# EasyEDA Pro project GD32E230CBT6_V1.0.0_2023-02-26.eprj

# Schematic GD32E230CBT6
Create Date: 2023-02-26; Page Name: GD32E230CBT6; Project Name: GD32E230CBT6_V1.0.0_2023-02-26; Schematic Name: GD32E230CBT6; Update Date: 2023-02-26; Company: 浙江工商大学; Drawed: 卷心菜; Page Size: A4; Part Number: JLCPCB-002; Reviewed: 卷心菜; Version: V1.0.0
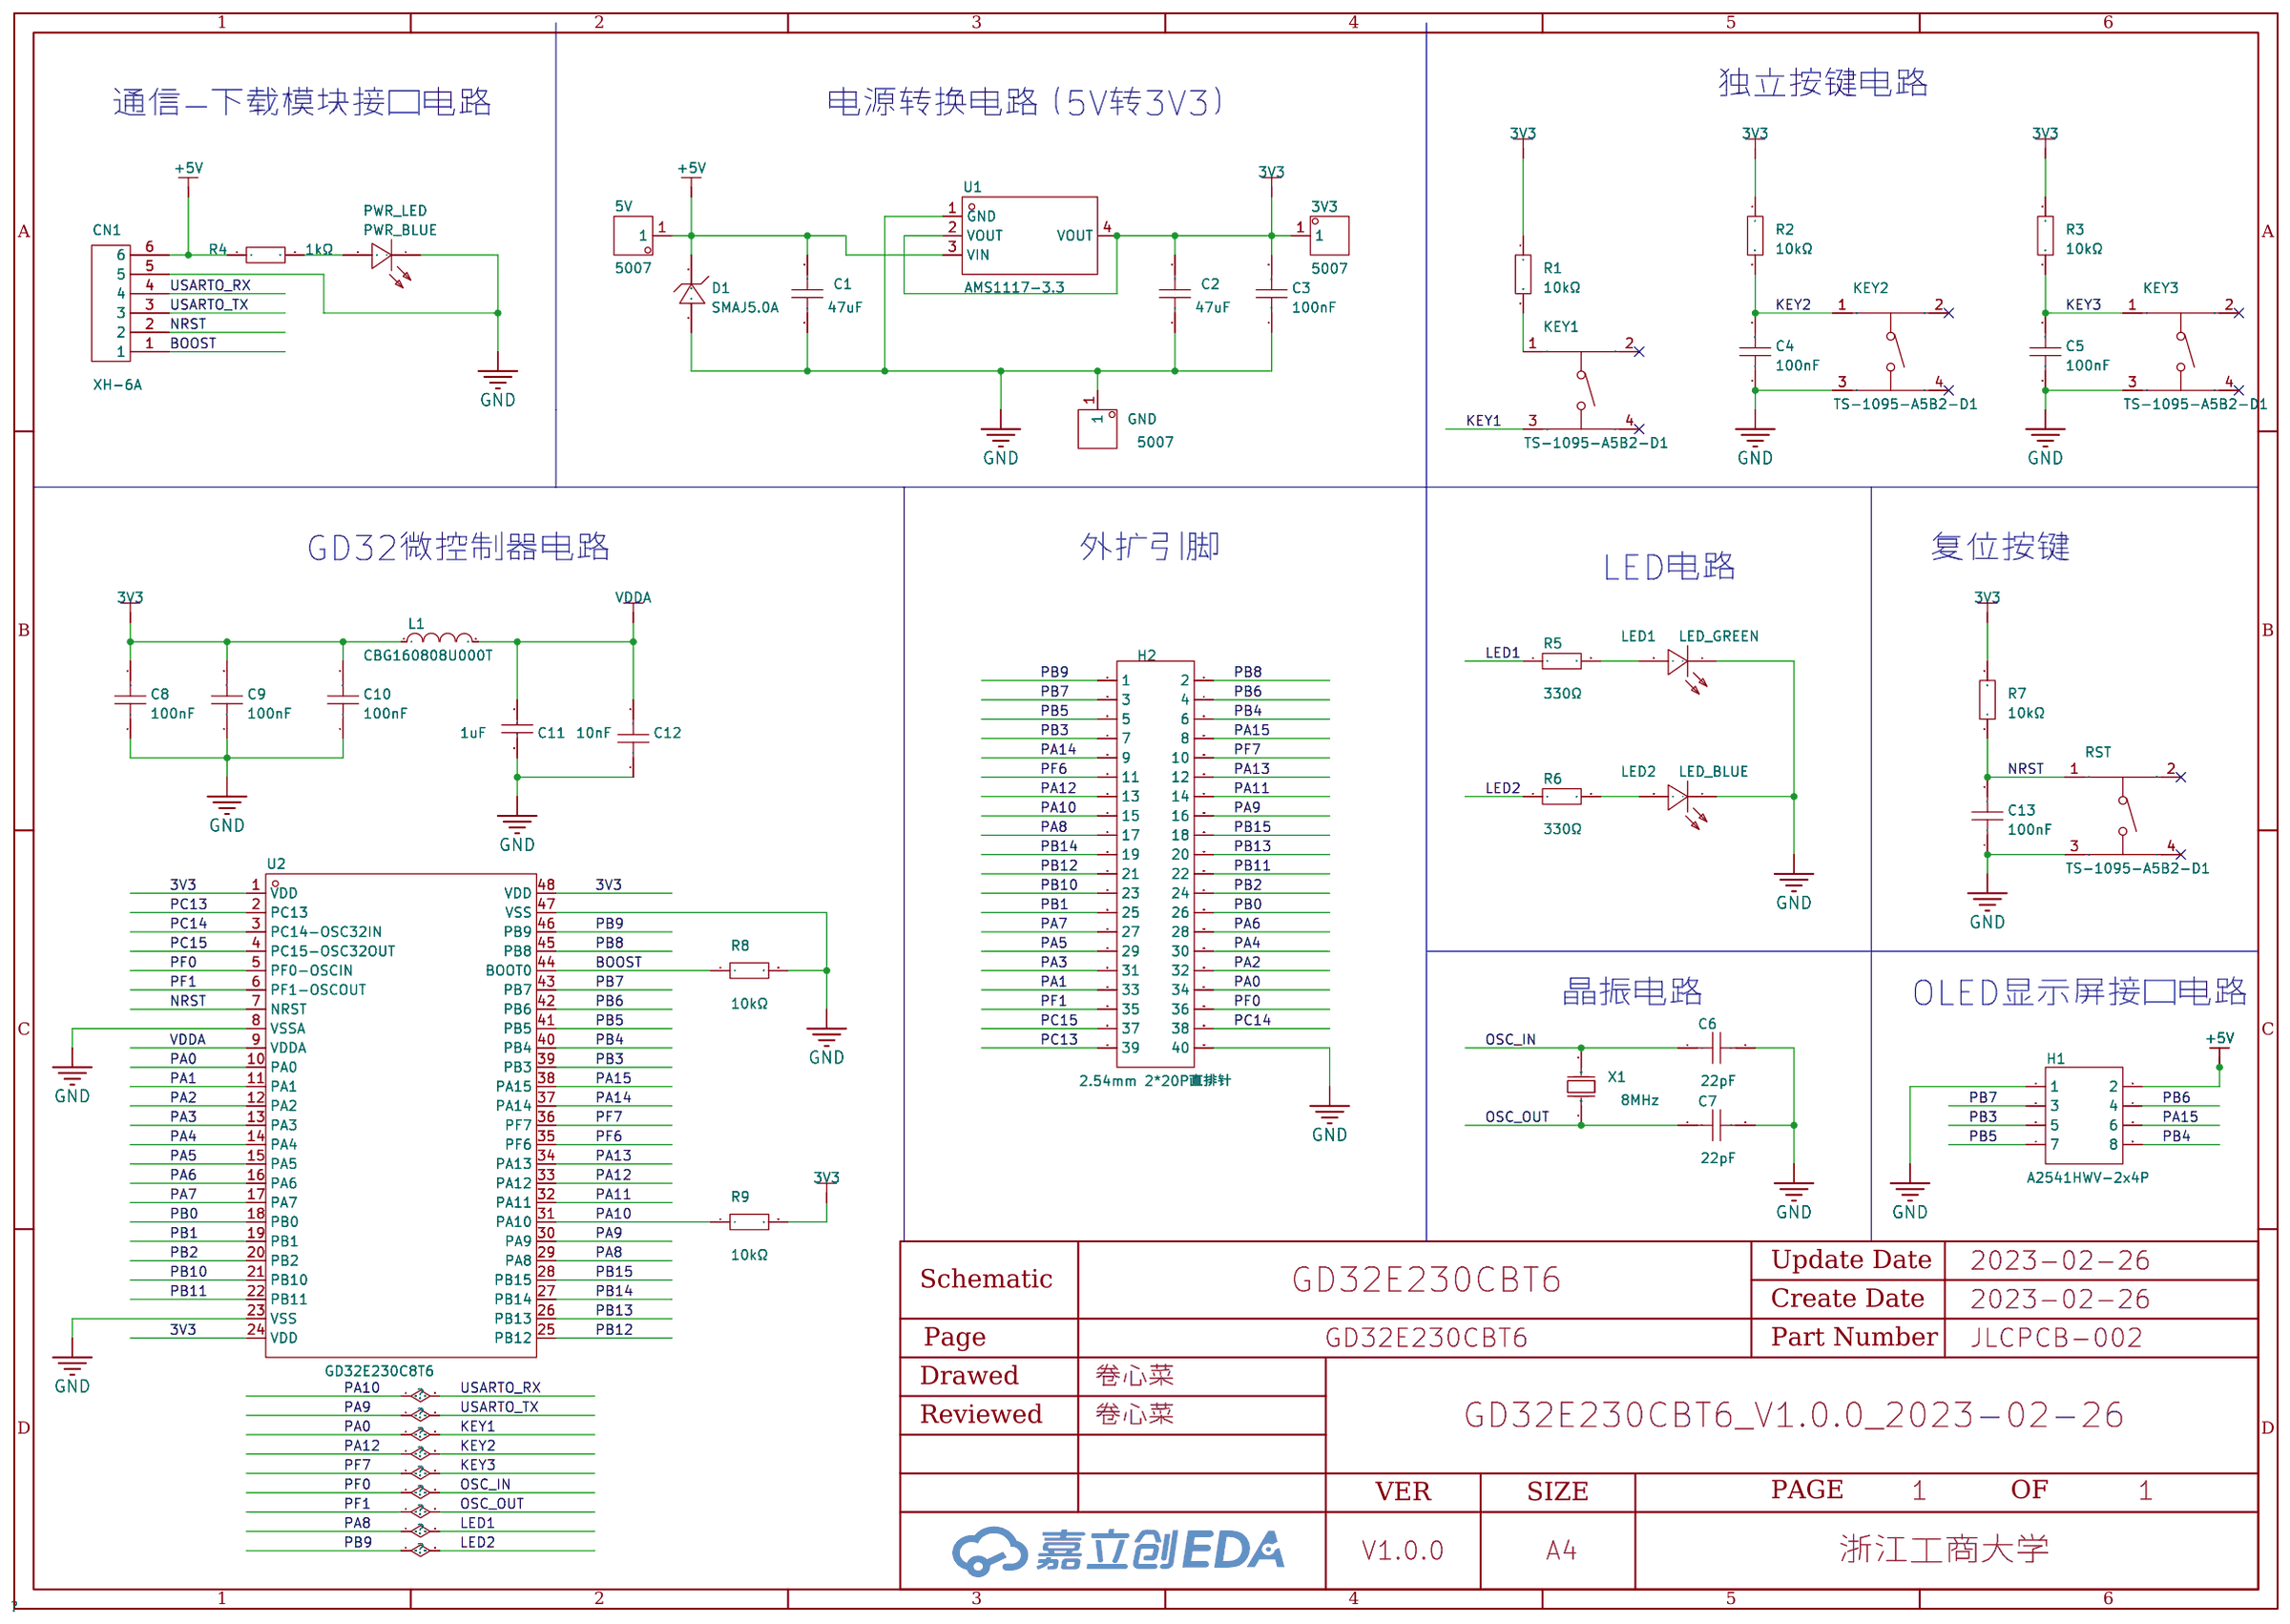
[diagram p0: schematic sheet]

## Parts
3V3  5007  [TEST-TH_BD3.18-P1.93]
5V  5007  [TEST-TH_BD3.18-P1.93]
C1  47uF  [C1206]
C2  47uF  [C1206]
C3  100nF  [C0603]
C4  100nF  [C0603]
C5  100nF  [C0603]
C6  22pF  [C0603]
C7  22pF  [C0603]
C8  100nF  [C0603]
C9  100nF  [C0603]
C10  100nF  [C0603]
C11  1uF  [C0603]
C12  10nF  [C0603]
C13  100nF  [C0603]
CN1  XH-6A  [CONN-TH_6P-P2.50_XH-6A]
D1  SMAJ5.0A  [SMA_L4.3-W2.6-LS5.2-RD]
GND  5007  [TEST-TH_BD3.18-P1.93]
H1  A2541HWV-2x4P  [HDR-TH_8P-P2.54-V-F-R2-C4-S2.54-1]
H2  2.54mm 2*20P直排针  [HDR-TH_40P-P2.54-V-M-R2-C20-S2.54]
KEY1  TS-1095-A5B2-D1  [SW-TH_4P-L6.0-W6.0-P4.50-LS6.5]
KEY2  TS-1095-A5B2-D1  [SW-TH_4P-L6.0-W6.0-P4.50-LS6.5]
KEY3  TS-1095-A5B2-D1  [SW-TH_4P-L6.0-W6.0-P4.50-LS6.5]
L1  CBG160808U000T  [L0603]
LED1  LED_GREEN  [LED0805-R-RD]
LED2  LED_BLUE  [LED0805-R-RD]
PWR_LED  PWR_BLUE  [LED0805-R-RD]
R1  10kΩ  [R0603]
R2  10kΩ  [R0603]
R3  10kΩ  [R0603]
R4  1kΩ  [R0603]
R5  330Ω  [R0603]
R6  330Ω  [R0603]
R7  10kΩ  [R0603]
R8  10kΩ  [R0603]
R9  10kΩ  [R0603]
RST  TS-1095-A5B2-D1  [SW-TH_4P-L6.0-W6.0-P4.50-LS6.5]
U1  AMS1117-3.3  [SOT-223-3_L6.5-W3.4-P2.30-LS7.0-BR]
U2  GD32E230C8T6  [LQFP-48_L7.0-W7.0-P0.50-LS9.0-BL]
X1  8MHz  [CRYSTAL-SMD_L11.5-W4.8-LS12.7]

## Library data of the parts
3V3 5V GND = YZ92015035T-04025-01: 2.0x3.5车件，打V形窝，4PIN-2.5间距；镀金3u；材质C3604，磁吸，散装; Supplier Part: C238125; Manufacturer: Keystone; JLCPCB Part Class: 扩展库; Datasheet: https://atta.szlcsc.com/upload/public/pdf/source/20180629/C238125_02BDDA36215D93753B818ECC7306422D.PDF; Supplier: LCSC
C1 C2 = GRM31CR61C476ME44L: 容值:47uF;精度:±20%;额定电压:16V;材质(温度系数):X5R;; LCSC Part Name: 47uF ±20% 16V; Supplier Part: C385047; Manufacturer: muRata(村田); Supplier Footprint: 1206; JLCPCB Part Class: 扩展库; Datasheet: https://atta.szlcsc.com/upload/public/pdf/source/20190520/C385047_976DAB2B198F62C3FC0888BB9E7F2E96.pdf; Supplier: LCSC; Tolerance: ±20%; Voltage Rated: 16V; Temperature Coefficient: X5R
C3-C5 C8-C10 C13 = CC0603KRX7R9BB104: 容值:100nF;精度:±10%;额定电压:50V;材质(温度系数):X7R;; LCSC Part Name: 100nF ±10% 50V; Supplier Part: C14663; Manufacturer: YAGEO(国巨); Supplier Footprint: 0603; JLCPCB Part Class: 基础库; Datasheet: https://atta.szlcsc.com/upload/public/pdf/source/20170116/1484561234239.pdf; Supplier: LCSC; Tolerance: ±10%; Voltage Rated: 50V; Temperature Coefficient: X7R
C6 C7 = 0603CG220J500NT: 容值:22pF;精度:±5%;额定电压:50V;材质(温度系数):C0G;; LCSC Part Name: 22pF ±5% 50V; Supplier Part: C91701; Manufacturer: FH(风华); Supplier Footprint: 0603; JLCPCB Part Class: 扩展库; Datasheet: https://atta.szlcsc.com/upload/public/pdf/source/20170923/C91701_1506149567492988977.pdf; Supplier: LCSC; Tolerance: ±5%; Voltage Rated: 50V; Temperature Coefficient: C0G
C11 = CC0603KRX5R8BB105: 容值:1uF;精度:±10%;额定电压:25V;材质(温度系数):X5R;; LCSC Part Name: 1uF ±10% 25V; Supplier Part: C14664; Manufacturer: YAGEO(国巨); Supplier Footprint: 0603; JLCPCB Part Class: 扩展库; Datasheet: https://atta.szlcsc.com/upload/public/pdf/source/20160606/1465200209684.pdf; Supplier: LCSC; Tolerance: ±10%; Voltage Rated: 25V; Temperature Coefficient: X5R
C12 = AC0603KRX7R9BB103: 容值:10nF;精度:±10%;额定电压:50V;材质(温度系数):X7R;; LCSC Part Name: 10nF ±10% 50V; Supplier Part: C149618; Manufacturer: YAGEO(国巨); Supplier Footprint: 0603; JLCPCB Part Class: 扩展库; Datasheet: https://atta.szlcsc.com/upload/public/pdf/source/20180620/C149618_71BD3AC72534FBA41BCFE3822A3523F4.pdf; Supplier: LCSC; Tolerance: ±10%; Voltage Rated: 50V; Temperature Coefficient: X7R
CN1 = XH-6A_C5663: 参考系列:XH;间距:2.5mm;插针结构:1x6P;排数:1;每排PIN数:6;行距:-;安装方式:-;触头材质:-;; LCSC Part Name: XH 2.5mm 1x6P; Supplier Part: C5663; Manufacturer: BOOMELE(博穆精密); Supplier Footprint: 插件,P=2.5mm; JLCPCB Part Class: 扩展库; Datasheet: https://atta.szlcsc.com/upload/public/pdf/source/20151222/1457707648819.pdf; Supplier: LCSC; Reference Series: XH; Pitch: 2.5mm; Pins Structure: 1x6P; Number of Rows: 1; Number of PINs Per Row: 6
D1 = SMAJ5.0A_C83329: 极性:单向;反向截止电压(Vrwm):5V;击穿电压:6.4V;峰值脉冲电流(Ipp)@10/1000s:-;最大钳位电压:9.2V;峰值脉冲功率(Ppp)@10/1000s:400W;; LCSC Part Name: 单向 Vrwm:5V 400W; Supplier Part: C83329; Manufacturer: Littelfuse(美国力特); Supplier Footprint: SMA(DO-214AC); JLCPCB Part Class: 扩展库; Datasheet: https://atta.szlcsc.com/upload/public/pdf/source/20170919/C83329_1505787404256977281.pdf; Supplier: LCSC; Polarity: 单向; Reverse Stand-Off Voltage (Vrwm): 5V; Breakdown Voltage: 6.4V; Maximum Clamping Voltage: 9.2V; Peak Pulse Power Dissipation (Ppp)@10/1000μs: 400W
H1 = A2541HWV-2x4P: 排数:双排;总孔位数:8;间距:2.54mm;插孔结构:2x4P;行距:2.54mm;安装类型:直插;塑高:-;触头材质:黄铜;触头镀层:金;; LCSC Part Name: 2.54mm 2x4P; Supplier Part: C239344; Manufacturer: CJT(长江连接器); Supplier Footprint: 直插,P=2.54mm; JLCPCB Part Class: 扩展库; Datasheet: https://atta.szlcsc.com/upload/public/pdf/source/20180724/C239344_5689AF3CE0863572E779D68311E1991C.pdf; Supplier: LCSC; Number of Rows: 双排; Number of Holes: 8; Pitch: 2.54mm; Holes Structure: 2x4P; Row Spacing: 2.54mm; Mounting Type: 直插; Contact Material: 黄铜; Contact Plating: 金
H2 = 2.54mm 2*20P直排针: 排数:双排;总PIN位数:40;间距:2.54mm;插针结构:2x20P;行距:2.54mm;安装类型:直插;圆针/方针:方针;额定电流:3A;额定电压:-;配合针长度:6mm;塑高:-;端接针长度:3mm;触头材质:黄铜;触头镀层:-;工作温度范围:-40℃~+105℃;颜色:黑色;; LCSC Part Name: 2.54mm 2x20P 直插 方针; Supplier Part: C50980; Manufacturer: BOOMELE(博穆精密); Supplier Footprint: 直插,P=2.54mm; JLCPCB Part Class: 扩展库; Datasheet: https://atta.szlcsc.com/upload/public/pdf/source/20151109/1457707571465.pdf; Supplier: LCSC; Number of Rows: 双排; Number of Pins: 40; Pitch: 2.54mm; Pin Structure: 2x20P; Row Spacing: 2.54mm; Mounting Type: 直插; Circluar Pins/Square Pins: 方针; Current Rating (Max): 3A; Length of Mating Pin: 6mm; Length of End Connection Pin: 3mm; Contact Material: 黄铜; Operating Temperature Range: -40℃~+105℃; Color: 黑色
KEY1-KEY3 RST = TS-1095-A5B2-D1: 电路结构:单刀单掷;安装方式:直插;按钮形状:圆形按钮;按钮/盖帽颜色:黑色;作用力:180gf@±30gf;引脚样式:PC引脚;开关长度:6mm;开关宽度:6mm;开关高度:6mm;带支架:否;; LCSC Part Name: 轻触开关6*6*6.0插件四脚DIP圆柄黑柄按键180gf; Supplier Part: C782808; Manufacturer: Yuandi(元迪); Supplier Footprint: 插件; JLCPCB Part Class: 扩展库; Datasheet: https://atta.szlcsc.com/upload/public/pdf/source/20200908/C782804_D14F61DCCBE05C7EE913124CF28857B3.pdf; Supplier: LCSC; Circuit: 单刀单掷; Mounting Style: 直插; Actuator Style: 圆形按钮; Actuator/Cap Color: 黑色; Operating Force: 180gf@±30gf; Pin Style: PC引脚; Switch Length: 6mm; Switch Width: 6mm; Switch Height: 6mm; Strike Gundam: 否
L1 = CBG160808U000T: 标称阻抗@测试频率:0Ω@100MHz;误差:0~15Ω;直流电阻(RDC):100mΩ;额定电流:800mA;电路数:1;; LCSC Part Name: 0Ω@100MHz 0~15Ω; Supplier Part: C43163; Manufacturer: FH(风华); Supplier Footprint: 0603; JLCPCB Part Class: 扩展库; Datasheet: https://atta.szlcsc.com/upload/public/pdf/source/20151026/1457707503572.pdf; Supplier: LCSC; Impedance @ Frequency: 0Ω@100MHz; Tolerance: 0~15Ω; DC Resistance: 100mΩ; Current Rating: 800mA; Circuits: 1
LED1 LED2 PWR_LED = NCD0805B2: 发光颜色:蓝灯;; LCSC Part Name: 蓝灯; Supplier Part: C84259; Manufacturer: 国星光电; Supplier Footprint: 0805; JLCPCB Part Class: 扩展库; Datasheet: https://atta.szlcsc.com/upload/public/pdf/source/20200820/C84259_E5AC6865415989C4C2C2831134BA3A23.pdf; Supplier: LCSC; Emitted Color: 蓝灯
R1-R3 R7-R9 = 0603WAF1002T5E: 电阻类型:厚膜电阻;阻值:10kΩ;精度:±1%;功率:100mW;温度系数:±100ppm/℃;最大工作电压:75V;工作温度范围:-55℃~+155℃;; LCSC Part Name: 10kΩ ±1% 100mW; Supplier Part: C25804; Manufacturer: UNI-ROYAL(厚声); Supplier Footprint: 0603; JLCPCB Part Class: 基础库; Datasheet: https://atta.szlcsc.com/upload/public/pdf/source/20200306/C422600_1E6D84923E4A46A82E41ADD87F860B5C.pdf; Supplier: LCSC; Type: 厚膜电阻; Tolerance: ±1%; Power(Watts): 100mW; Temperature Coefficient: ±100ppm/℃; Overload Voltage (Max): 75V; Operating Temperature Range: -55℃~+155℃
R4 = 0603WAF1001T5E: 电阻类型:厚膜电阻;阻值:1kΩ;精度:±1%;功率:100mW;温度系数:±100ppm/℃;最大工作电压:75V;工作温度范围:-55℃~+155℃;; LCSC Part Name: 1kΩ ±1% 100mW; Supplier Part: C21190; Manufacturer: UNI-ROYAL(厚声); Supplier Footprint: 0603; JLCPCB Part Class: 基础库; Datasheet: https://atta.szlcsc.com/upload/public/pdf/source/20200306/C422600_1E6D84923E4A46A82E41ADD87F860B5C.pdf; Supplier: LCSC; Type: 厚膜电阻; Tolerance: ±1%; Power(Watts): 100mW; Temperature Coefficient: ±100ppm/℃; Overload Voltage (Max): 75V; Operating Temperature Range: -55℃~+155℃
R5 R6 = 0603WAF3300T5E: 电阻类型:厚膜电阻;阻值:330Ω;精度:±1%;功率:100mW;温度系数:±100ppm/℃;最大工作电压:75V;工作温度范围:-55℃~+155℃;; LCSC Part Name: 330Ω ±1% 100mW; Supplier Part: C23138; Manufacturer: UNI-ROYAL(厚声); Supplier Footprint: 0603; JLCPCB Part Class: 基础库; Datasheet: https://atta.szlcsc.com/upload/public/pdf/source/20200306/C422600_1E6D84923E4A46A82E41ADD87F860B5C.pdf; Supplier: LCSC; Type: 厚膜电阻; Tolerance: ±1%; Power(Watts): 100mW; Temperature Coefficient: ±100ppm/℃; Overload Voltage (Max): 75V; Operating Temperature Range: -55℃~+155℃
U1 = AMS1117-3.3_C6186: 输出类型:固定;输出极性:正;输出通道数:1;最大输入电压:-;输出电压:3.3V;压差:1.3V@(800mA);静态电流(地电流):-;输出电流:1A;电源纹波抑制比(PSRR):72dB@(120Hz);噪声:-;特性:-;工作温度:-;; LCSC Part Name: 正 Vout=3.3V 1A 72dB@(120Hz); Supplier Part: C6186; Manufacturer: AMS; Supplier Footprint: SOT-223-3; JLCPCB Part Class: 基础库; Datasheet: https://atta.szlcsc.com/upload/public/pdf/source/20180727/C6186_7A095716F0823C02F1997A905E26C086.pdf; Supplier: LCSC; Output Type: 固定; Output Polarity: 正; Number of Outputs: 1; Output Voltage: 3.3V; Dropout Voltage: 1.3V@(800mA); Output Current: 1A; Power Supply Rejection Ratio (PSRR): 72dB@(120Hz)
U2 = GD32E230C8T6: CPU内核:ARM Cortex-M23;CPU最大主频:72MHz;工作电压范围:1.8V~3.6V;内部振荡器:有;外部时钟频率范围:4MHz~32MHz;程序 FLASH容量:64KB;RAM总容量:8KB;EEPROM/数据 FLASH容量:-;GPIO端口数量:39;ADC(单元数/通道数/位数):1@x10ch/12bit;DAC(单元数/通道数/位数):-;(E)PWM(单元数/通道数/位数):1@x16bit;8位Timer数量:-;16位Timer数量:6;32位Timer数量:-;内部; LCSC Part Name: ARM Cortex-M23 72MHz 闪存：64KB RAM：8KB; Supplier Part: C380535; Manufacturer: GigaDevice(兆易创新); Supplier Footprint: LQFP-48; JLCPCB Part Class: 扩展库; Datasheet: https://atta.szlcsc.com/upload/public/pdf/source/20191028/C380535_2A3608A1B122F87D1E8A29B0B3E313D6.pdf; Supplier: LCSC; CPU Core: ARM Cortex-M23; Maximum Frequency: 72MHz; Supply Voltage Range: 1.8V~3.6V; Internal Oscillator: 有; External Clock Frequency Rang: 4MHz~32MHz; Program FLASH Size: 64KB; RAM Size: 8KB; GPIO Ports Number: 39; ADC (Units/Channels/bits): 1@x10ch/12bit; (E)PWM (Units/Channels/bits): 1@x16bit; 16Bit Timer Number: 6; CMP Number: 1; U(S)ART Number: 2; I2C Number: 2; (Q)SPI Number: 2; Peripherals / Functions / Protocol Stacks: 片载温度传感器；DMA；看门狗；LIN总线协议；PWM；IrDA；RTC实时时钟; Operating Temperature Range: -40℃~+85℃
X1 = X49SM8MSD2SC: 晶振类型:49SMD;频率:8MHz;频率公差:±20ppm;频率稳定度:±30ppm;负载电容:20pF;工作温度:-20℃~+70℃;; LCSC Part Name: HC-49SMD 8MHz ±20ppm 20pF; Supplier Part: C12674; Manufacturer: YXC(扬兴晶振); Supplier Footprint: HC-49S-SMD-2P; JLCPCB Part Class: 基础库; Datasheet: https://atta.szlcsc.com/upload/public/pdf/source/20210329/C106809_0E91E60850A780B284B63D653DC40EA4.pdf; Supplier: LCSC; Crystal Type: 49SMD; Frequency Tolerance: ±20ppm; Frequency Stability: ±30ppm; Load Capacitance: 20pF; Operating Temperature: -20℃~+70℃

## Nets
3V3: 3V3.1 C2.2 C3.2 C8.2 C9.2 C10.2 L1.1 R1.1 R2.1 R3.1 R7.1 R9.2 U1.2(VOUT) U1.4(VOUT) U2.1(VDD) U2.24(VDD) U2.48(VDD)
+5V: 5V.1 C1.2 CN1.6 D1.1(C) H1.2 R4.1 U1.3(VIN)
GND: C1.1 C2.1 C3.1 C4.1 C5.1 C6.2 C7.2 C8.1 C9.1 C10.1 C11.1 C12.1 C13.1 CN1.5 D1.2(A) GND.1 H1.1 H2.40 KEY2.3 KEY3.3 LED1.1(-) LED2.1(-) PWR_LED.1(-) R8.2 RST.3 U1.1(GND) U2.8(VSSA) U2.23(VSS) U2.47(VSS)
VDDA: C11.2 C12.2 L1.2 U2.9(VDDA)
BOOST: CN1.1 R8.1 U2.44(BOOT0)
KEY1: H2.34 KEY1.3 U2.10(PA0)
KEY2: C4.2 H2.13 KEY2.1 R2.2 U2.33(PA12)
KEY3: C5.2 H2.10 KEY3.1 R3.2 U2.36(PF7)
LED1: H2.17 R5.1 U2.29(PA8)
LED2: H2.1 R6.1 U2.46(PB9)
NRST: C13.2 CN1.2 R7.2 RST.1 U2.7(NRST)
OSC_IN: C6.1 H2.36 U2.5(PF0-OSCIN) X1.2(OSC2)
OSC_OUT: C7.1 H2.35 U2.6(PF1-OSCOUT) X1.1(OSC1)
PA1: H2.33 U2.11(PA1)
PA2: H2.32 U2.12(PA2)
PA3: H2.31 U2.13(PA3)
PA4: H2.30 U2.14(PA4)
PA5: H2.29 U2.15(PA5)
PA6: H2.28 U2.16(PA6)
PA7: H2.27 U2.17(PA7)
PA9: CN1.3 H2.16 U2.30(PA9)
PA10: CN1.4 H2.15 R9.1 U2.31(PA10)
PA11: H2.14 U2.32(PA11)
PA13: H2.12 U2.34(PA13)
PA14: H2.9 U2.37(PA14)
PA15: H1.6 H2.8 U2.38(PA15)
PB0: H2.26 U2.18(PB0)
PB1: H2.25 U2.19(PB1)
PB2: H2.24 U2.20(PB2)
PB3: H1.5 H2.7 U2.39(PB3)
PB4: H1.8 H2.6 U2.40(PB4)
PB5: H1.7 H2.5 U2.41(PB5)
PB6: H1.4 H2.4 U2.42(PB6)
PB7: H1.3 H2.3 U2.43(PB7)
PB8: H2.2 U2.45(PB8)
PB10: H2.23 U2.21(PB10)
PB11: H2.22 U2.22(PB11)
PB12: H2.21 U2.25(PB12)
PB13: H2.20 U2.26(PB13)
PB14: H2.19 U2.27(PB14)
PB15: H2.18 U2.28(PB15)
PC13: H2.39 U2.2(PC13)
PC14: H2.38 U2.3(PC14-OSC32IN)
PC15: H2.37 U2.4(PC15-OSC32OUT)
PF6: H2.11 U2.35(PF6)
$1N2065: PWR_LED.2(+) R4.2
$1N2813: KEY1.1 R1.2
$1N5640: LED2.2(+) R6.2
$1N21501: LED1.2(+) R5.2

Not connected (* = marked no-connect by the designer): KEY1 2* 4*; KEY2 2* 4*; KEY3 2* 4*; RST 2* 4*

## Notes on the sheet
- 独立按键电路
- 通信—下载模块接口电路
- 电源转换电路（5V转3V3）
- GD32微控制器电路
- 外扩引脚
- 复位按键
- LED电路
- 晶振电路
- OLED显示屏接口电路

# Board GD32E230CBT6
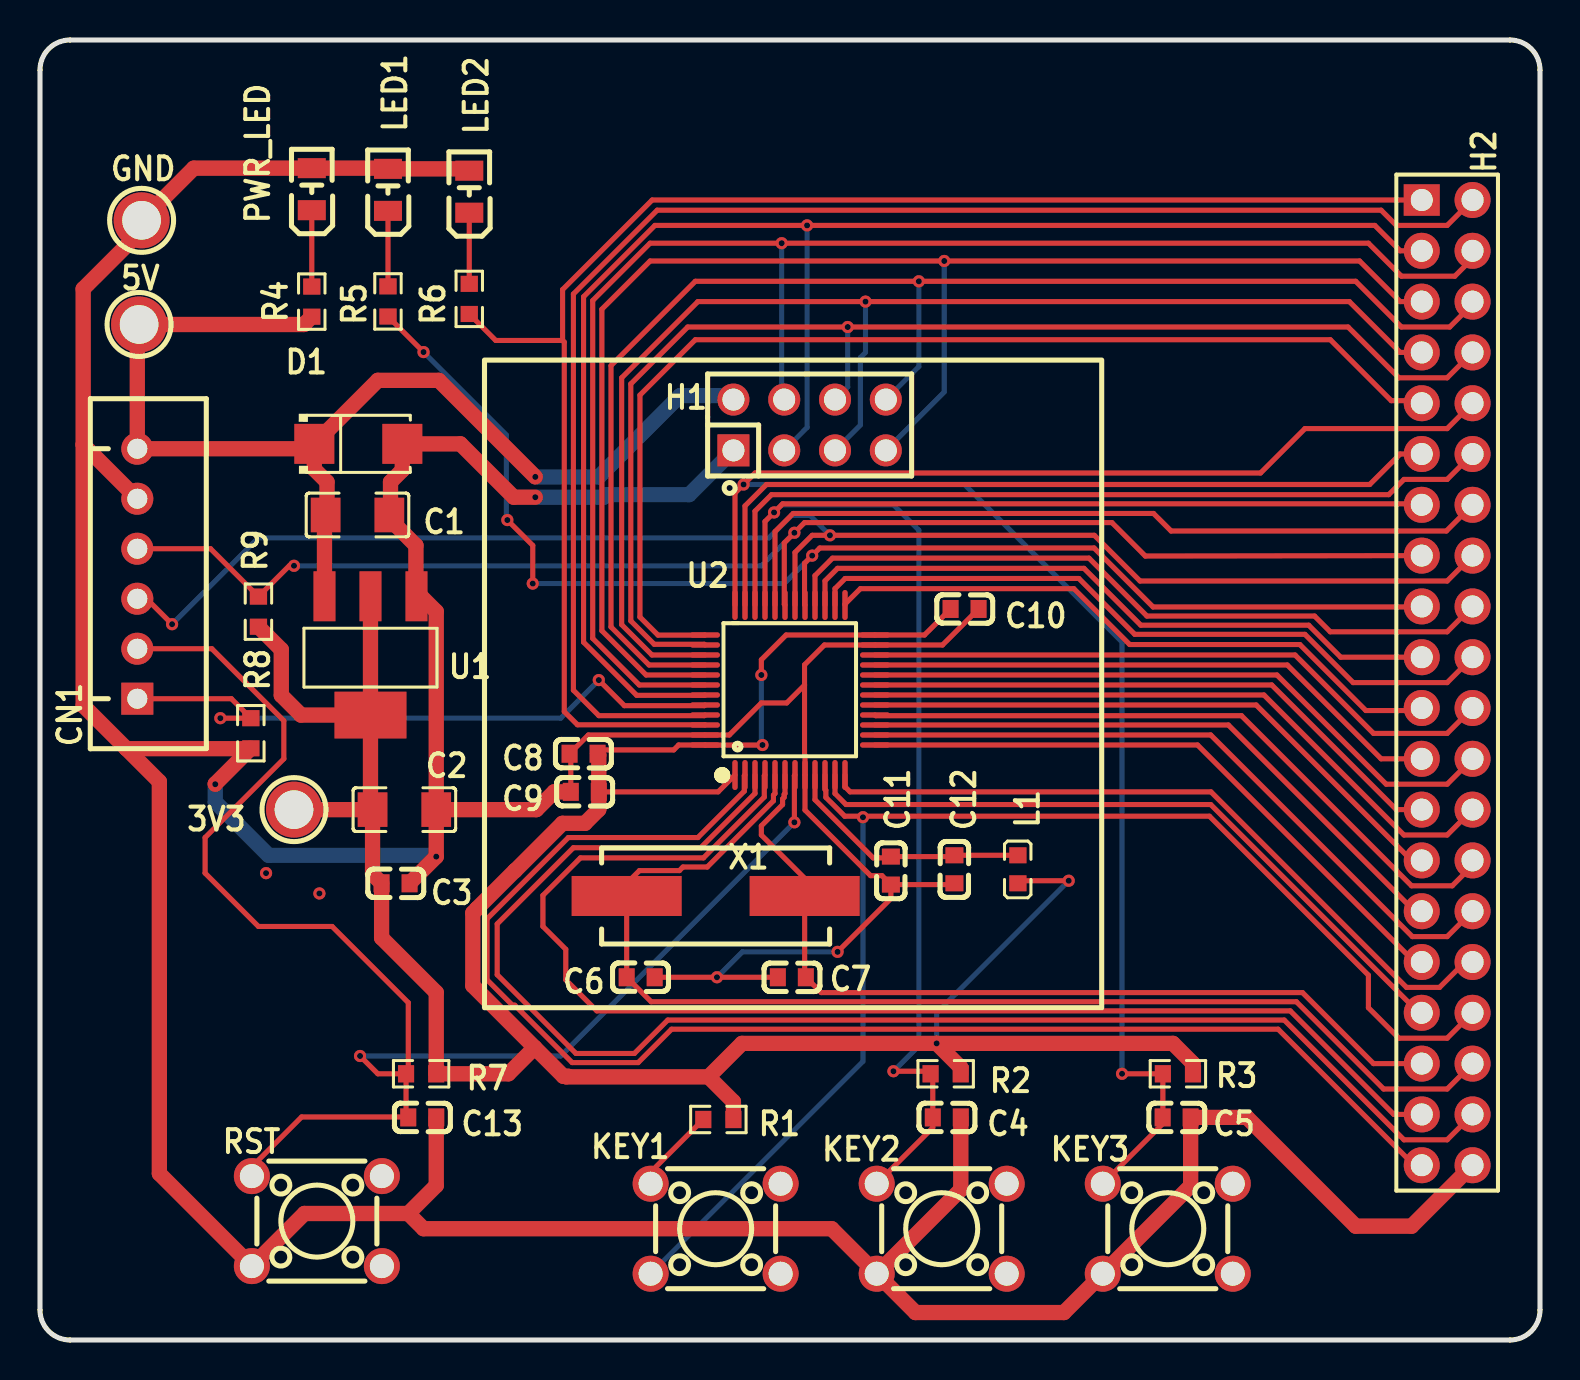
[diagram p1: board, top side]
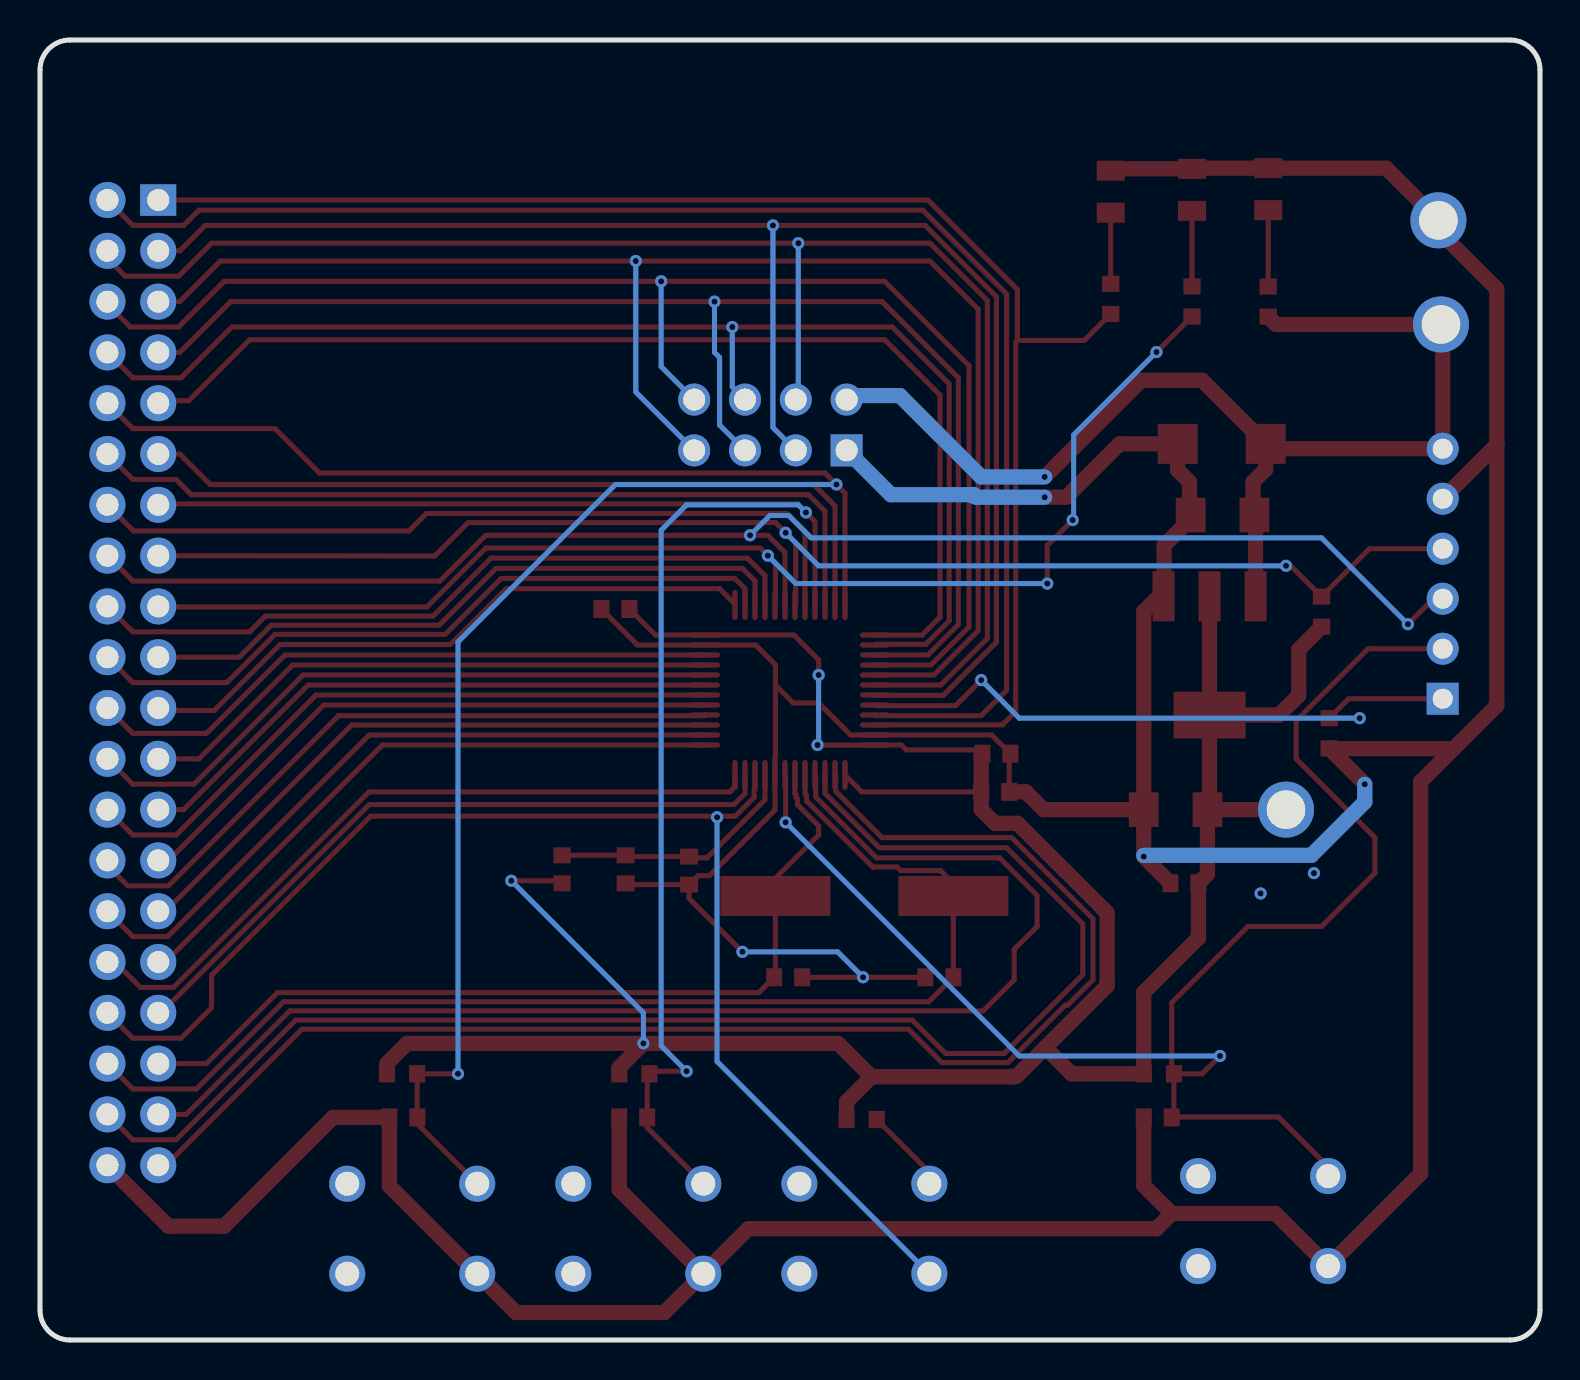
[diagram p2: board, bottom side, seen from below]

Outline 75 x 65 mm; copper layers: Top Layer, Bottom Layer. Coordinates in mm from the lower left corner of the outline.
Outline path: 0,63.5 0,1.5 arc(0.44,0.44) 1.5,0 73.5,0 arc(74.56,0.44) 75,1.5 75,63.5 arc(74.56,64.56) 73.5,65 1.5,65 arc(0.44,64.56) 0,63.5
Stack: Top Layer 0.035mm / Dielectric1 1.51mm FR4 er 4.5 / Bottom Layer 0.035mm

## Design rules (mm)
spacing safeClearance (default): track to track 0.152, other pairs 0.152 to 0.3
track width trackWidth (default): min 0.254, default 0.254, max 0.762
track width VCC and GND: min 0.254, default 0.762, max 0.762
differential pair differentialPair (default): width min 0.127, default 0.254, max 2.54; gap min 0.152, default 0.152
via viaSize (default): diameter min 0.5, default 0.61, max 10; hole min 0.3, default 0.305, max 5.999
net GND uses VCC and GND
net +5V uses VCC and GND
net 3V3 uses VCC and GND

## Placement (name value [footprint] x y rotation side)
3V3  5007  [TEST-TH_BD3.18-P1.93]  12.7 26.52 0 top
5V  5007  [TEST-TH_BD3.18-P1.93]  4.95 50.78 0 top
C1  47uF  [C1206]  15.88 41.25 180 top
C2  47uF  [C1206]  18.22 26.52 180 top
C3  100nF  [C0603]  17.78 22.84 180 top
C4  100nF  [C0603]  45.34 11.13 180 top
C5  100nF  [C0603]  56.83 11.13 180 top
C6  22pF  [C0603]  30.03 18.14 0 top
C7  22pF  [C0603]  37.59 18.14 180 top
C8  100nF  [C0603]  27.18 29.31 0 top
C9  100nF  [C0603]  27.24 27.41 0 top
C10  100nF  [C0603]  46.23 36.55 180 top
C11  1uF  [C0603]  42.54 23.47 90 top
C12  10nF  [C0603]  45.72 23.54 90 top
C13  100nF  [C0603]  19.11 11.13 180 top
CN1  XH-6A  [CONN-TH_6P-P2.50_XH-6A]  4.87 38.31 90 top
D1  SMAJ5.0A  [SMA_L4.3-W2.6-LS5.2-RD]  15.92 44.81 0 top
GND  5007  [TEST-TH_BD3.18-P1.93]  5.08 55.98 0 top
H1  A2541HWV-2x4P  [HDR-TH_8P-P2.54-V-F-R2-C4-S2.54-1]  38.48 45.75 0 top
H2  2.54mm 2*20P直排针  [HDR-TH_40P-P2.54-V-M-R2-C20-S2.54]  70.36 32.87 270 top
KEY1  TS-1095-A5B2-D1  [SW-TH_4P-L6.0-W6.0-P4.50-LS6.5]  33.78 5.56 0 top
KEY2  TS-1095-A5B2-D1  [SW-TH_4P-L6.0-W6.0-P4.50-LS6.5]  45.09 5.56 0 top
KEY3  TS-1095-A5B2-D1  [SW-TH_4P-L6.0-W6.0-P4.50-LS6.5]  56.39 5.56 0 top
L1  CBG160808U000T  [L0603]  48.9 23.54 90 top
LED1  LED_GREEN  [LED0805-R-RD]  17.4 57.51 90 top
LED2  LED_BLUE  [LED0805-R-RD]  21.46 57.41 90 top
PWR_LED  PWR_BLUE  [LED0805-R-RD]  13.59 57.54 90 top
R1  10kΩ  [R0603]  33.92 11.03 180 top
R2  10kΩ  [R0603]  45.28 13.31 180 top
R3  10kΩ  [R0603]  56.9 13.31 180 top
R4  1kΩ  [R0603]  13.59 51.92 90 top
R5  330Ω  [R0603]  17.4 51.93 90 top
R6  330Ω  [R0603]  21.46 52.05 90 top
R7  10kΩ  [R0603]  19.06 13.31 180 top
R8  10kΩ  [R0603]  10.54 30.34 270 top
R9  10kΩ  [R0603]  10.92 36.42 270 top
RST  TS-1095-A5B2-D1  [SW-TH_4P-L6.0-W6.0-P4.50-LS6.5]  13.84 5.94 0 top
U1  AMS1117-3.3  [SOT-223-3_L6.5-W3.4-P2.30-LS7.0-BR]  16.52 34.22 90 top
U2  GD32E230C8T6  [LQFP-48_L7.0-W7.0-P0.50-LS9.0-BL]  37.5 32.5 0 top
X1  8MHz  [CRYSTAL-SMD_L11.5-W4.8-LS12.7]  33.78 22.2 180 top

## Footprints (pads in the part's own frame, mm; a bottom-side part is the same pattern mirrored in y, then rotated)
C0603
  rect 0.8x0.9 smd: 1(-0.7,0) 2(0.7,0)
C1206
  rect 1.485x1.728 smd: 1(-1.593,0) 2(1.593,0)
CONN-TH_6P-P2.50_XH-6A
  rect 1.6x1.6 hole 1: 1(-6.25,0)
  round 1.6 hole 1: 2(-3.75,0) 3(-1.25,0) 4(1.25,0) 5(3.75,0) 6(6.25,0)
CRYSTAL-SMD_L11.5-W4.8-LS12.7
  rect 5.5x2 smd: 1(-4.45,0) 2(4.45,0)
HDR-TH_8P-P2.54-V-F-R2-C4-S2.54-1
  rect 1.6x1.6 hole 1.1: 1(-3.81,-1.27)
  round 1.6 hole 1.1: 2(-3.81,1.27) 3(-1.27,-1.27) 4(-1.27,1.27) 5(1.27,-1.27) 6(1.27,1.27) 7(3.81,-1.27) 8(3.81,1.27)
HDR-TH_40P-P2.54-V-M-R2-C20-S2.54
  rect 1.575x1.8 hole 1.1: 1(-24.13,-1.27)
  round 1.8 hole 1.1: 2(-24.13,1.27) 3(-21.59,-1.27) 4(-21.59,1.27) 5(-19.05,-1.27) 6(-19.05,1.27) 7(-16.51,-1.27) 8(-16.51,1.27) 9(-13.97,-1.27) 10(-13.97,1.27) 11(-11.43,-1.27) 12(-11.43,1.27) 13(-8.89,-1.27) 14(-8.89,1.27) 15(-6.35,-1.27) 16(-6.35,1.27) 17(-3.81,-1.27) 18(-3.81,1.27) 19(-1.27,-1.27) 20(-1.27,1.27) 21(1.27,-1.27) 22(1.27,1.27) 23(3.81,-1.27) 24(3.81,1.27) 25(6.35,-1.27) 26(6.35,1.27) 27(8.89,-1.27) 28(8.89,1.27) 29(11.43,-1.27) 30(11.43,1.27) 31(13.97,-1.27) 32(13.97,1.27) 33(16.51,-1.27) 34(16.51,1.27) 35(19.05,-1.27) 36(19.05,1.27) 37(21.59,-1.27) 38(21.59,1.27) 39(24.13,-1.27) 40(24.13,1.27)
L0603
  rect 0.8x0.864 smd: 1(-0.7,0) 2(0.7,0)
LED0805-R-RD
  rect 1x1.399 smd: 1(1.05,0) 2(-1.05,0)
LQFP-48_L7.0-W7.0-P0.50-LS9.0-BL
  oval 0.27x1.5 smd: 1(-2.75,-4.25) 2(-2.25,-4.25) 3(-1.75,-4.25) 4(-1.25,-4.25) 5(-0.75,-4.25) 6(-0.25,-4.25) 7(0.25,-4.25) 8(0.75,-4.25) 9(1.25,-4.25) 10(1.75,-4.25) 11(2.25,-4.25) 12(2.75,-4.25) 25(2.75,4.25) 26(2.25,4.25) 27(1.75,4.25) 28(1.25,4.25) 29(0.75,4.25) 30(0.25,4.25) 31(-0.25,4.25) 32(-0.75,4.25) 33(-1.25,4.25) 34(-1.75,4.25) 35(-2.25,4.25) 36(-2.75,4.25)
  oval 1.5x0.27 smd: 13(4.25,-2.75) 14(4.25,-2.25) 15(4.25,-1.75) 16(4.25,-1.25) 17(4.25,-0.75) 18(4.25,-0.25) 19(4.25,0.25) 20(4.25,0.75) 21(4.25,1.25) 22(4.25,1.75) 23(4.25,2.25) 24(4.25,2.75) 37(-4.25,2.75) 38(-4.25,2.25) 39(-4.25,1.75) 40(-4.25,1.25) 41(-4.25,0.75) 42(-4.25,0.25) 43(-4.25,-0.25) 44(-4.25,-0.75) 45(-4.25,-1.25) 46(-4.25,-1.75) 47(-4.25,-2.25) 48(-4.25,-2.75)
R0603
  rect 0.806x0.864 smd: 1(-0.753,0) 2(0.753,0)
SMA_L4.3-W2.6-LS5.2-RD
  rect 2x2 smd: 1(-2.2,0) 2(2.2,0)
SOT-223-3_L6.5-W3.4-P2.30-LS7.0-BR
  rect 2.5x1.1 smd: 1(2.97,-2.3) 2(2.97,0) 3(2.97,2.3)
  rect 2.34x3.6 smd: 4(-2.97,0)
SW-TH_4P-L6.0-W6.0-P4.50-LS6.5
  round 1.8 hole 1.2: 1(-3.25,2.25) 2(3.25,2.25) 3(-3.25,-2.25) 4(3.25,-2.25)
TEST-TH_BD3.18-P1.93
  round 2.8 hole 1.93: 1(0,0)

## Nets
As in the schematic.

Pads without a net: KEY1 2 4; KEY2 2 4; KEY3 2 4; RST 2 4

## Via types
v1: diameter 0.61, hole 0.305, Top Layer to Bottom Layer, 35 vias

## Routing (per net, layer and track width the routed paths; a pad name or vN(x,y) marks a point on that pad's centre or on a via; arc(x,y) is an arc through that point)
3V3: length 146.4
  Top Layer w0.254: v1(36.07,33.25) 36.07,34.01 37.31,35.25 U2.24 44.23,35.25 C10.2 ; 27.94,29.25 28.19,29.5 31.69,29.5 31.93,29.75 U2.48 33.25,29.75 36.12,29.75 v1(36.12,29.75) ; v1(51.44,22.96) 49.02,22.96 L1.1 ; C9.2 33.91,27.41 U2.1
  Top Layer w0.762: U1.2 U1.4 ; U1.4 16.52,26.62 ; U1.4 13.05,31.25 12.06,32.23 12.06,34.52 R9.2 ; v1(44.83,14.83) 35.1,14.83 33.43,13.16 ; v1(44.83,14.83) 56.65,14.83 57.65,13.83 R3.1 ; v1(44.83,14.83) 46.04,13.62 R2.1 ; 16.52,26.62 16.42,26.52 3V3.1 ; 16.52,26.62 C2.2 16.63,23.29 C3.2 17.08,20.11 19.81,17.38 19.81,13.31 R7.1 23.42,13.31 24.73,14.62 ; C8.2 27.94,29.25 C9.2 27.94,26.53 27.25,25.83 26.12,25.83 23.75,23.47 23.75,23.47 21.84,21.57 21.84,21.56 21.64,21.35 21.64,17.72 24.73,14.62 ; 33.43,13.16 26.31,13.16 26.42,13.18 26.17,13.18 24.73,14.62 ; 33.43,13.16 34.67,11.91 R1.1
  Bottom Layer w0.254: v1(36.07,33.25) 36.07,29.81 v1(36.12,29.75) ; v1(44.83,14.83) 44.83,16.36 v1(51.44,22.96)
+5V: length 58
  Top Layer w0.762: D1.1 13.72,43.54 14.35,42.9 14.35,41.32 C1.2 14.22,41.19 U1.3 ; D1.1 13.47,44.56 CN1.6 4.87,50.69 5V.1 13.2,50.78 R4.1 ; D1.1 16.89,47.98 19.94,47.98 v1(24.76,43.16)
  Bottom Layer w0.762: v1(24.76,43.16) 27.94,43.16 32,47.22 34.47,47.22 H1.2
GND: length 297
  Top Layer w0.254: C9.1 26.54,29.38 ; 26.54,29.38 27.41,30.25 U2.47 34.47,30.25 36.07,31.85 37.34,31.85 38.23,32.74 ; 26.54,29.38 C8.1 ; C11.1 42.1,23.22 41.53,23.22 38.25,26.5 U2.8 38.25,29.16 38.23,29.19 38.23,32.74 ; C11.1 45.66,22.77 C12.1 ; C11.1 42.54,22.07 v1(39.88,19.41) ; 38.23,32.74 38.23,33.76 39.22,34.75 U2.23 45.13,34.75 C10.1 ; C7.2 v1(33.85,18.14) C6.2
  Top Layer w0.762: CN1.5 2.16,44.77 ; 2.16,44.77 2.16,52.55 5.08,55.47 GND.1 7.69,58.59 PWR_LED.1 17.36,58.59 LED1.1 21.37,58.56 LED2.1 ; 2.16,44.77 2.16,31.73 4.32,29.57 ; C3.1 v1(19.81,24.17) C2.1 ; 4.32,29.57 10.52,29.57 ; 4.32,29.57 5.97,27.92 5.97,8.32 RST.3 13.22,6.33 18.41,6.33 ; 10.52,29.57 R8.2 ; 10.52,29.57 8.76,27.81 v1(8.76,27.79) ; H2.40 68.58,5.69 65.79,5.69 60.35,11.13 57.53,11.13 57.53,7.71 KEY3.3 51.2,1.37 43.78,1.37 KEY2.3 ; v1(24.76,42.14) 23.69,42.14 21.02,44.81 D1.2 18.12,43.49 17.53,42.9 17.53,41.31 ; C4.1 46.04,7.52 KEY2.3 ; 17.53,41.31 17.53,41 18.8,39.73 18.8,37.22 U1.1 19.05,37.19 19.81,36.42 C2.1 ; 17.53,41.31 C1.1 ; C13.1 19.81,7.72 18.41,6.33 ; KEY2.3 39.59,5.56 19.18,5.56 18.41,6.33 ; C2.1 24.82,26.52 25.71,27.41 C9.1
  Bottom Layer w0.254: v1(39.88,19.41) 35.12,19.41 v1(33.85,18.14)
  Bottom Layer w0.762: 28.32,42.27 32.46,42.27 34.67,44.48 ; 28.32,42.27 28.34,42.19 ; 28.32,42.27 28.19,42.14 v1(24.76,42.14) ; v1(8.76,27.79) 8.76,26.9 11.43,24.23 19.81,24.23
  vias: v1(11.3,23.34) v1(13.97,22.33)
VDDA: length 12.6
  Top Layer w0.254: U2.9 38.75,27.01 41.66,24.11 42.48,24.11 C11.2 45.66,24.17 C12.2 48.89,24.24
BOOST: length 33.2
  Top Layer w0.254: v1(9.02,31.09) R8.1 9.57,32.06 CN1.1 ; v1(27.94,33) 29.22,31.72 33.22,31.72 U2.44
  Bottom Layer w0.254: v1(27.94,33) 26.03,31.09 v1(9.02,31.09)
KEY1: length 67.2
  Top Layer w0.254: H2.34 70.36,15.09 67.94,15.09 66.42,16.61 66.42,18.24 58.47,26.19 40.24,26.19 39.29,27.13 39.29,27.49 39.25,27.53 U2.10
  Bottom Layer w0.254: KEY1.3 41.15,13.93 v1(41.15,26.14)
KEY2: length 81.8
  Top Layer w0.254: U2.33 36.25,40.92 v1(36.7,41.38) 37.13,41.81 69.04,41.81 H2.13 ; v1(42.67,13.44) 44.4,13.44 R2.2 ; KEY2.1 44.64,10.62 44.64,13.46 44.53,13.56
  Bottom Layer w0.254: v1(36.7,41.38) 37.08,41.76 42.67,41.76 43.94,40.49 43.94,14.71 v1(42.67,13.44)
KEY3: length 97.1
  Top Layer w0.254: 56.14,13.56 R3.2 ; R3.2 56.14,11.29 56.13,11.28 56.13,10.81 KEY3.1 ; R3.2 v1(54.1,13.31) ; H2.10 70.36,45.57 63.25,45.57 61.03,43.35 35.75,43.35 v1(35.18,42.78) 34.75,42.35 U2.36
  Bottom Layer w0.254: v1(54.1,13.31) 54.1,34.9 46.23,42.78 v1(35.18,42.78)
LED1: length 65.4
  Top Layer w0.254: R5.1 v1(19.18,49.4) ; H2.17 69.06,36.65 55.65,36.65 52.71,39.6 38.99,39.6 v1(38.61,39.22) 38.23,38.84 38.23,36.77 U2.29 ; v1(23.37,41) 24.64,39.73 v1(24.64,37.82)
  Bottom Layer w0.254: v1(19.18,49.4) 23.32,45.26 23.32,41.05 v1(23.37,41) ; v1(24.64,37.82) 37.21,37.82 v1(38.61,39.22)
LED2: length 78.5
  Top Layer w0.254: U2.46 33.24,30.76 26.87,30.76 26.21,31.42 26.21,49.89 26.13,49.98 ; H2.1 30.61,57 26.13,52.52 26.13,49.98 ; 21.46,51.3 22.79,49.98 26.13,49.98
NRST: length 77.6
  Top Layer w0.254: 18.3,13.31 18.41,13.42 18.41,16.87 14.61,20.68 10.92,20.68 8.25,23.34 8.25,25.12 12.19,29.06 12.19,30.96 8.59,34.56 CN1.2 ; 18.3,13.31 16.89,13.31 v1(16,14.2) ; 18.3,13.31 18.3,11.24 18.39,11.15 ; RST.1 10.59,8.66 13.08,11.15 18.39,11.15 ; 18.39,11.15 C13.2 ; U2.7 37.72,28.22 v1(37.72,25.88)
  Bottom Layer w0.254: v1(37.72,25.88) 26.03,14.2 v1(16,14.2)
OSC_IN: length 60.2
  Top Layer w0.254: U2.5 36.75,27.32 36.67,27.25 36.67,26.96 33.36,23.65 32.15,23.65 31.97,23.47 29.97,23.47 29.33,22.83 X1.2 29.33,22.2 C6.1 30.56,16.91 62.82,16.91 67.18,12.55 70.36,12.55 H2.36
OSC_OUT: length 44.1
  Top Layer w0.254: H2.35 66.68,13.82 63.12,17.37 39.06,17.37 C7.1 38.23,18.2 X1.1 38.23,23.08 36.07,25.25 36.07,25.71 37.13,26.77 37.13,27.06 37.21,27.13 37.21,27.28 37.25,27.32 U2.6
PA1: length 34.8
  Top Layer w0.254: H2.33 68.95,16.36 58.54,26.77 40.3,26.77 39.75,27.32 U2.11
PA2: length 36.6
  Top Layer w0.254: U2.12 40.25,27.66 40.5,27.41 58.55,27.41 68.33,17.63 69.98,17.63 71.25,18.9 H2.32
PA3: length 31.8
  Top Layer w0.254: H2.31 68.73,18.9 57.88,29.75 U2.13
PA4: length 34.6
  Top Layer w0.254: U2.14 58.54,30.25 68.62,20.17 70.36,20.17 H2.30
PA5: length 31.2
  Top Layer w0.254: H2.29 68.96,21.57 68.6,21.57 59.42,30.75 U2.15
PA6: length 34.1
  Top Layer w0.254: H2.28 71.63,23.72 70.61,22.71 68.58,22.71 60.07,31.22 41.78,31.22 U2.16
PA7: length 30.6
  Top Layer w0.254: U2.17 60.81,31.75 68.58,23.98 H2.27
PA9: length 76.2
  Top Layer w0.254: H2.16 70.36,37.95 55,37.95 52.72,40.23 v1(39.5,40.23) 38.61,40.23 37.75,39.38 U2.30 ; CN1.3 5.33,37.06 v1(6.6,35.79)
  Bottom Layer w0.254: v1(6.6,35.79) 10.92,40.11 36.45,40.11 37.57,41.23 38.51,41.23 v1(39.5,40.23)
PA10: length 71.3
  Top Layer w0.254: U2.31 37.22,36.78 37.22,39.86 v1(37.72,40.36) 38.23,40.87 53.59,40.87 55.27,39.2 H2.15 ; v1(12.7,38.71) 12.46,38.71 R9.1 8.53,39.56 CN1.4
  Bottom Layer w0.254: v1(12.7,38.71) 36.07,38.71 v1(37.72,40.36)
PA11: length 39.8
  Top Layer w0.254: H2.14 70.32,40.45 56.56,40.45 55.68,41.33 37.66,41.33 36.75,40.42 U2.32
PA13: length 41.8
  Top Layer w0.254: U2.34 35.75,41.44 36.58,42.27 67.44,42.27 68.2,43.03 70.36,43.03 H2.12
PA14: length 56.3
  Top Layer w0.254: H2.9 68.96,46.97 67.56,46.97 64.52,50.01 32.77,50.01 30,47.25 30,36.15 30.9,35.24 33.24,35.24 U2.37
PA15: length 64.8
  Top Layer w0.254: H2.8 70.36,48.11 67.94,48.11 65.41,50.65 v1(40.39,50.65) 32.38,50.65 29.54,47.8 29.54,35.96 30.71,34.78 33.22,34.78 U2.38
  Bottom Layer w0.254: v1(40.39,50.65) 40.39,47.66 H1.6
PB0: length 33.3
  Top Layer w0.254: H2.26 70.36,25.25 68.2,25.25 61.2,32.25 U2.18
PB1: length 29.9
  Top Layer w0.254: H2.25 67.82,26.52 61.59,32.75 U2.19
PB2: length 32.7
  Top Layer w0.254: H2.24 70.36,27.79 67.31,27.79 61.85,33.25 U2.20
PB3: length 67.8
  Top Layer w0.254: U2.39 30.6,34.25 29.08,35.77 29.08,48.11 32.89,51.92 v1(41.28,51.92) 65.47,51.92 68.01,49.38 H2.7
  Bottom Layer w0.254: v1(41.28,51.92) 41.28,49.38 41.02,49.12 41.02,45.75 39.75,44.48
PB4: length 71.5
  Top Layer w0.254: H2.6 71.63,51.79 70.49,50.65 68.07,50.65 65.79,52.94 v1(43.94,52.94) 32.77,52.94 28.55,48.72 28.55,35.65 30.45,33.75 U2.40
  Bottom Layer w0.254: v1(43.94,52.94) 43.94,48.67 H1.8
PB5: length 75.7
  Top Layer w0.254: H2.5 68.01,51.92 65.98,53.95 v1(45.21,53.95) 30.51,53.95 28.09,51.54 28.09,35.46 30.31,33.25 U2.41
  Bottom Layer w0.254: 42.29,44.48 45.21,47.4 v1(45.21,53.95)
PB6: length 78
  Top Layer w0.254: U2.42 29.96,32.75 27.63,35.08 27.63,51.97 30.5,54.84 v1(37.08,54.84) 66.42,54.84 68.07,53.19 70.74,53.19 71.63,54.08 H2.4
  Bottom Layer w0.254: 37.21,47.02 37.08,47.15 v1(37.08,54.84)
PB7: length 80.1
  Top Layer w0.254: U2.43 33.23,32.23 29.83,32.23 27.18,34.89 27.18,52.16 30.75,55.73 v1(38.35,55.73) 66.74,55.73 68.01,54.46 H2.3
  Bottom Layer w0.254: 37.21,44.48 38.35,45.62 v1(38.35,55.73)
PB8: length 74.5
  Top Layer w0.254: U2.45 33.22,31.22 27.94,31.22 26.67,32.49 26.67,52.3 30.86,56.49 67.06,56.49 67.82,55.73 70.36,55.73 H2.2
PB10: length 29.3
  Top Layer w0.254: H2.23 67.06,29.06 62.37,33.75 U2.21
PB11: length 32
  Top Layer w0.254: H2.22 70.36,30.33 66.68,30.33 62.75,34.25 U2.22
PB12: length 31.8
  Top Layer w0.254: U2.25 40.25,36.8 41.02,37.57 51.69,37.57 54.48,34.77 62.99,34.77 66.29,31.47 68.96,31.47 H2.21
PB13: length 35.6
  Top Layer w0.254: H2.20 70.36,32.87 65.66,32.87 63.25,35.28 54.74,35.28 51.94,38.08 40.26,38.08 39.75,37.57 U2.26
PB14: length 33.1
  Top Layer w0.254: H2.19 65.04,34.14 63.44,35.74 55.04,35.74 52.2,38.58 39.88,38.58 39.25,37.96 U2.27
PB15: length 36.8
  Top Layer w0.254: U2.28 38.75,38.22 39.62,39.09 52.45,39.09 55.35,36.2 63.73,36.2 64.52,35.41 70.36,35.41 H2.18
PC13: length 71.3
  Top Layer w0.254: H2.39 68.71,8.74 61.91,15.54 31.58,15.54 29.91,13.87 26.61,13.87 23.74,16.74 23.62,16.74 22.35,18.01 22.35,21.06 26.42,25.12 32.9,25.12 35.22,27.44 35.22,28.22 U2.2
PC14: length 73.2
  Top Layer w0.254: U2.3 35.75,27.33 33.03,24.61 26.67,24.61 22.86,20.8 22.86,18.26 26.8,14.33 29.72,14.33 31.39,16 62.21,16 68.2,10.01 70.36,10.01 H2.38
PC15: length 64.5
  Top Layer w0.254: H2.37 67.69,11.28 62.51,16.46 27.84,16.46 26.29,18.01 26.29,19.53 25.15,20.68 25.15,22.23 27.02,24.11 33.17,24.11 36.22,27.15 36.22,28.22 U2.4
PF6: length 39.9
  Top Layer w0.254: H2.11 68.01,44.3 66.49,42.78 36.32,42.78 35.25,41.7 U2.35
$1N2065: length 3.8
  Top Layer w0.254: PWR_LED.2 R4.2
$1N2813: length 4.3
  Top Layer w0.254: R1.2 30.53,8.39 KEY1.1
$1N5640: length 3.6
  Top Layer w0.254: R6.2 LED2.2
$1N21501: length 3.8
  Top Layer w0.254: R5.2 LED1.2

## Copper pours and planes (outline as drawn; the poured copper is in the pictures)
GND on Top Layer: -123.7,65.89 -47.75,65.89 -47.75,-0.91 -123.7,-0.91
GND on Bottom Layer: 81.79,111.99 157.73,111.99 157.73,45.06 81.79,45.06
